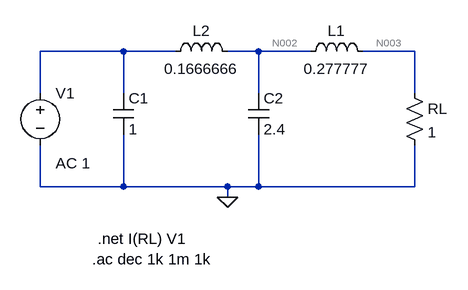
[diagram p0: schematic EJ_1C.asc]
EJ_1C.asc, the LTspice schematic file:
Version 4
SHEET 1 880 680
WIRE -64 48 -192 48
WIRE 16 48 -64 48
WIRE 144 48 96 48
WIRE 224 48 144 48
WIRE 384 48 304 48
WIRE -192 112 -192 48
WIRE -64 112 -64 48
WIRE 144 112 144 48
WIRE 384 112 384 48
WIRE -192 256 -192 192
WIRE -64 256 -64 176
WIRE -64 256 -192 256
WIRE 96 256 -64 256
WIRE 144 256 144 176
WIRE 144 256 96 256
WIRE 384 256 384 192
WIRE 384 256 144 256
WIRE 96 272 96 256
FLAG 96 272 0
SYMBOL cap -80 112 R0
SYMATTR InstName C1
SYMATTR Value 1
SYMBOL cap 128 112 R0
SYMATTR InstName C2
SYMATTR Value 2.4
SYMBOL ind 208 64 R270
WINDOW 0 32 56 VTop 2
WINDOW 3 5 56 VBottom 2
SYMATTR InstName L1
SYMATTR Value 0.277777
SYMBOL ind 0 64 R270
WINDOW 0 32 56 VTop 2
WINDOW 3 5 56 VBottom 2
SYMATTR InstName L2
SYMATTR Value 0.1666666
SYMBOL voltage -192 96 R0
WINDOW 123 24 124 Left 2
WINDOW 39 0 0 Left 0
SYMATTR Value2 AC 1
SYMATTR InstName V1
SYMATTR Value ""
SYMBOL res 368 96 R0
SYMATTR InstName RL
SYMATTR Value 1
TEXT -104 336 Left 2 !.net I(RL) V1
TEXT -112 368 Left 2 !.ac dec 1k 1m 1k

The netlist it stands for:
* EJ_1C.asc
C1 N001 0 1
C2 N002 0 2.4
L1 N002 N003 0.277777
L2 N001 N002 0.1666666
V1 N001 0 AC 1
RL N003 0 1
.net I(RL) V1
.ac dec 1k 1m 1k
.backanno
.end

* Results of the author's LTspice run, read from the files saved beside the schematic
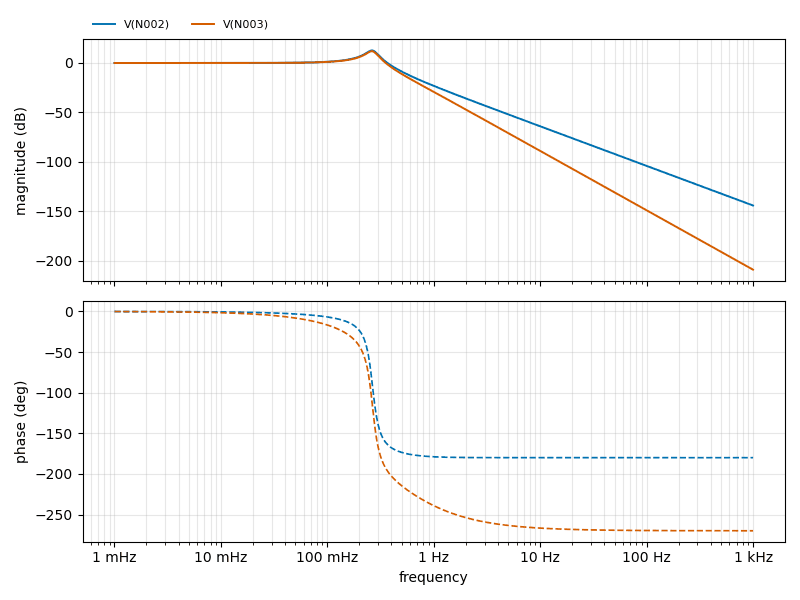
[diagram p1: AC Analysis of EJ_1C.asc, plotted from the saved traces]
* AC Analysis, 1 run:
*   V(N002): -0.01 dB at 1 mHz, -143.97 dB at 1 kHz, peak 12.72 dB at 262.4 mHz, 3 dB below the peak at 229.7 mHz and 291.2 mHz
*   V(N003): -0.02 dB at 1 mHz, -208.81 dB at 1 kHz, peak 11.89 dB at 261.8 mHz, 3 dB below the peak at 228.2 mHz and 290.1 mHz